# EAGLE design RoboCore RGB Sensor (EAGLE 9.6.2)
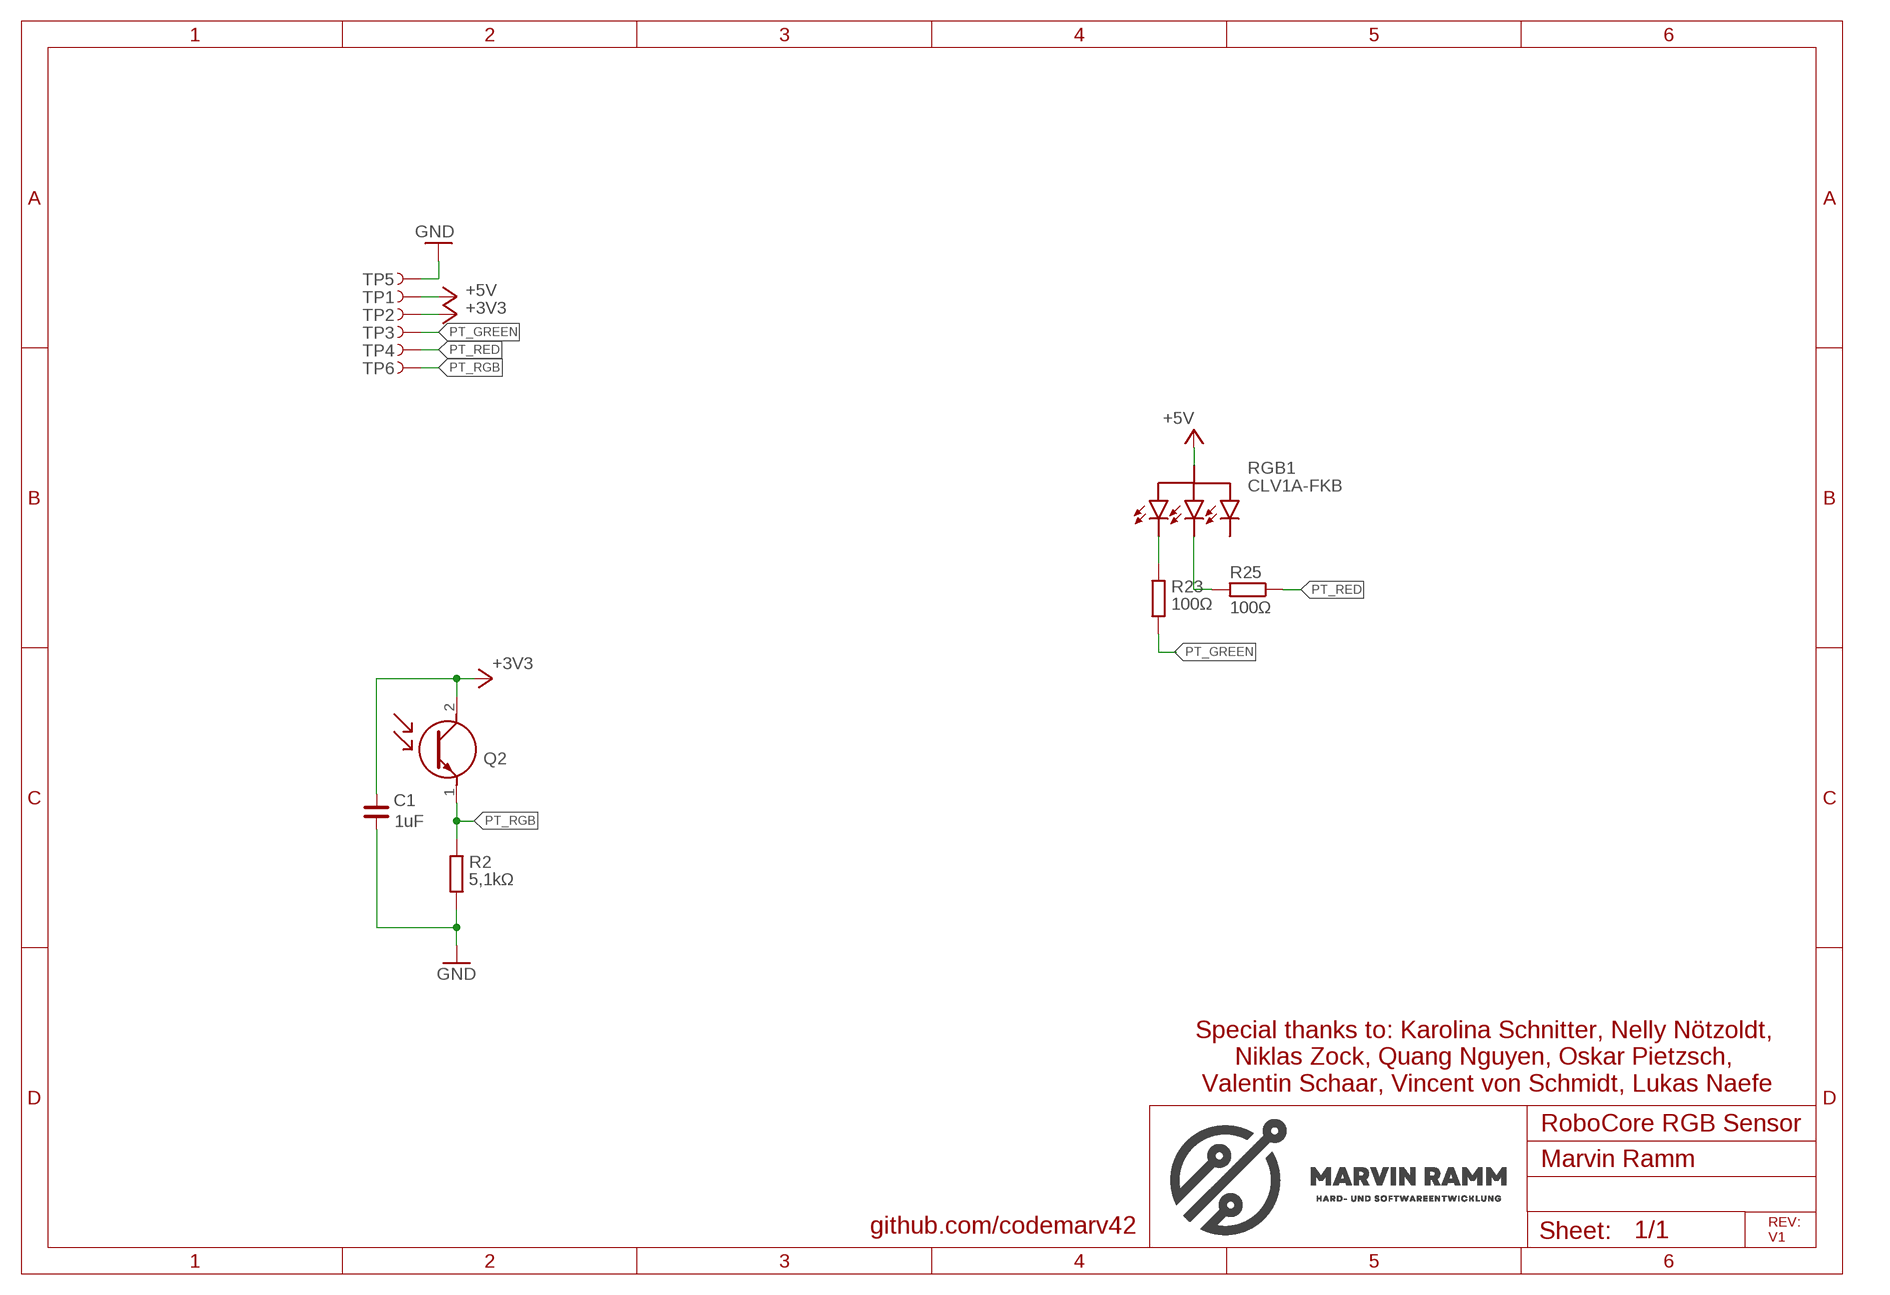
[diagram p0: schematic, sheet 1]

## Parts
C1  1uF  C_0402  [C0402]
Q2  PT17-21C/L41/TR8  [0805]
R2  5,1kΩ  R_0402  [R0402]
R23  100Ω  R_0402  [R0402]
R25  100Ω  R_0402  [R0402]
RGB1  RGBLED  [RGBLED]
TP1  TEST-POINT3X5  [PAD.03X.05]
TP2  TEST-POINT3X5  [PAD.03X.05]
TP3  TEST-POINT3X5  [PAD.03X.05]
TP4  TEST-POINT3X5  [PAD.03X.05]
TP5  TEST-POINT3X5  [PAD.03X.05]
TP6  TEST-POINT3X5  [PAD.03X.05]

## Nets
+3V3: C1.2 Q2.2(C) TP2.1
+5V: RGB1.+5V TP1.1
GND: C1.1 R2.2 TP5.1
N$50: R23.1 RGB1.P3
N$52: R25.1 RGB1.P2
PT_GREEN: R23.2 TP3.1
PT_RED: R25.2 TP4.1
PT_RGB: Q2.1(E) R2.1 TP6.1
Unconnected: RGB1.P1

## Notes on the sheet
- RGB1
- CLV1A-FKB
- Special thanks to: Karolina Schnitter, Nelly Nötzoldt, 
  Niklas Zock, Quang Nguyen, Oskar Pietzsch, 
  Valentin Schaar, Vincent von Schmidt, Lukas Naefe
- Marvin Ramm
- github.com/codemarv42
- REV:
  V1

## Library data of the parts
C1 = rc-master-smd:C_: NON-POLARIZED CAP
Q2 = Eigene Library:PT17-21C/L41/TR8
R2 R23 R25 = rc-master-smd:R_: RESISTOR
RGB1 = RGB LED:RGBLED
TP1-TP6 = SparkFun-Connectors:TEST-POINT: SparkFun Test Points Bare copper test points for troubleshooting or In-Circuit-Testing. These are used by our Production team for verifying production board runs using pogo-pins on test beds. SparkFun Products: SparkFun LSM9DS1 Breakout <https://www.sparkfun.com/products/13284> SparkFun PSOC <https://www.sparkfun.com/products/13714> SparkFun Load Cell Amplifier <https://www.sparkfun.com/products/13879>

## Board
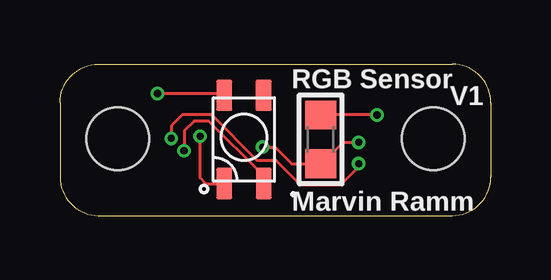
[diagram p1: board, top side]
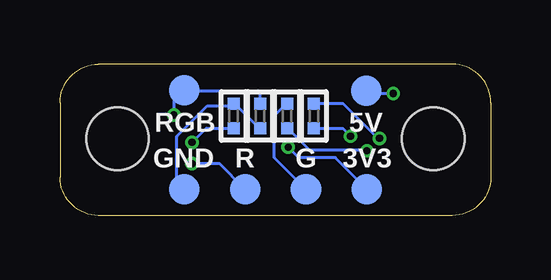
[diagram p2: board, bottom side, seen from below]

Size 17.95 x 6.3 mm. Coordinates in mm from the lower left corner, seen from the top.
Outline: 1.6,0 16.35,0 arc90 17.95,1.6 17.95,4.7 arc90 16.35,6.3 1.6,6.3 arc90 0,4.7 0,1.6 arc90 1.6,0
Copper layers (1*16): Top 0.035mm / dielectric 1.53mm / Bottom 0.035mm
Design rules "JLCPCB_1-2layer *": minimum track width 5mil, minimum drill 0.3mm, track to track 5mil, track to pad 0.2mm, pad to pad 7mil, via to via 7mil, smd to smd 7mil, copper to edge 20mil, drill to drill 6mil, minimum pad ring 6mil, minimum via ring 0.13mm, stop-mask expansion 0.1mm, vias tented up to drill 20mil, thermal gap 10mil
Holes 2.6 mm at 2.4,3.2 15.55,3.2

### Footprints (pad centres in the part's own frame; a part is rotated, then mirrored left to right if it is on the bottom)
C0402 = smd 0.5 x 0.5: 1 -0.508,0; 2 0.508,0
0805 = smd 1.2 x 1.3: 1 -1.016,0; 2 1.016,0
R0402 = smd 0.5 x 0.5: 1 -0.508,0; 2 0.508,0
RGBLED = smd 0.686 x 1.3: +5V -1.456,1.996; P1 0.184,1.996; P2 -1.458,-1.678; P3 0.192,-1.678
PAD.03X.05 = smd 1.27 x 1.27: 1 0,0

### Placement (x,y rotation side)
C1  10.72,4.15 270 bottom
Q2  10.86,3.17 270 top
R2  9.61,4.15 270 bottom
R23  8.49,4.15 90 bottom
R25  7.37,4.15 90 bottom
RGB1  8.3,3.01 0 top
TP1  5.18,5.2 180 bottom
TP2  5.16,1.1 0 bottom
TP3  7.7,1.1 0 bottom
TP4  10.24,1.1 0 bottom
TP5  12.78,1.1 0 bottom
TP6  12.78,5.21 180 bottom

### Tracks (layer width: path | path; a pad name or v marks a point on that pad's centre or on a via)
+3V3  (via drill 0.3)
  Top 0.127: v12.45,3.05 11.81,3.05 10.92,2.16 Q2.2 9.66,2.15 8.96,2.85 v8.44,2.85
  Bottom 0.127: C1.2 11.85,3.65 v12.45,3.05 | TP2.1 6.47,2.41 8.01,2.41 v8.44,2.85
+5V  (via drill 0.3)
  Top 0.127: v4.06,5.08 6.73,5.08 RGB1.+5V
  Bottom 0.127: v4.06,5.08 5.08,5.08 TP1.1
GND
  Bottom 0.127: R2.2 9.65,3.68 9.68,3.68 10.69,4.69 C1.1 10.79,4.57 11.81,4.57 13.08,3.3 13.08,1.4 12.83,1.14 TP5.1
N$50  (via drill 0.3)
  Top 0.127: v5.17,2.7 5.19,2.72 5.19,3.54 5.59,3.94 6.2,3.94 8.38,1.75 8.38,1.4 RGB1.P3
  Bottom 0.127: v5.17,2.7 5.22,2.75 7.57,2.75 8.38,3.56 R23.1
N$52  (via drill 0.3)
  Top 0.127: v5.84,3.3 5.84,1.57 6.08,1.33 RGB1.P2
  Bottom 0.127: v5.84,3.3 6.16,3.62 7.37,3.62 R25.1
PT_GREEN
  Bottom 0.127: R23.2 8.51,4.66 9.02,4.15 9.02,2.41 7.75,1.14 TP3.1
PT_RED  (via drill 0.3)
  Top 0.127: v4.64,3.21 4.64,3.74 5.09,4.19 6.31,4.19 8.22,2.29 9.02,2.29 10.03,1.27 11.68,1.27 12.45,2.03 v12.45,2.16
  Bottom 0.127: v4.64,3.21 4.7,3.21 6.14,4.65 R25.2 | v12.45,2.16 11.3,2.16 10.29,1.14 TP4.1
PT_RGB  (via drill 0.3)
  Top 0.127: v13.21,4.19 10.92,4.19 Q2.1
  Bottom 0.127: R2.1 9.62,4.67 9.62,5.14 9.69,5.21 12.7,5.21 TP6.1 12.83,5.21 13.21,4.83 v13.21,4.19

### Text on the board
tPlace: RGB Sensor | V1 | Marvin Ramm
bPlace: 5V | RGB | 3V3 | G | R | GND